# Altium schematic sheet Eurocard VME 6U P1.schdoc: FPGA Motherboard for Digital Multiplexed Readout, McGill U.
size B; DocumentNumber: DfMUX24; Revision: Rev0, Prototype; SheetNumber: 24; SheetTotal: 27; PageSetup: Record=PageOptions|CenterHorizontal=True|CenterVertical=True|PrintScale=1.08|XCorrection=1.00|YCorrection=1.00|PrintKind=0|BorderSize=5000000|LeftOffset=0|BottomOffset=0|Orientation=2|PaperLength=1000|PaperWidth=1000|Scale=100|PaperSource=7|PrintQuality=-4|MediaType=1|DitherType=10|PaperKind=Tabloid|PrintScaleMode=1
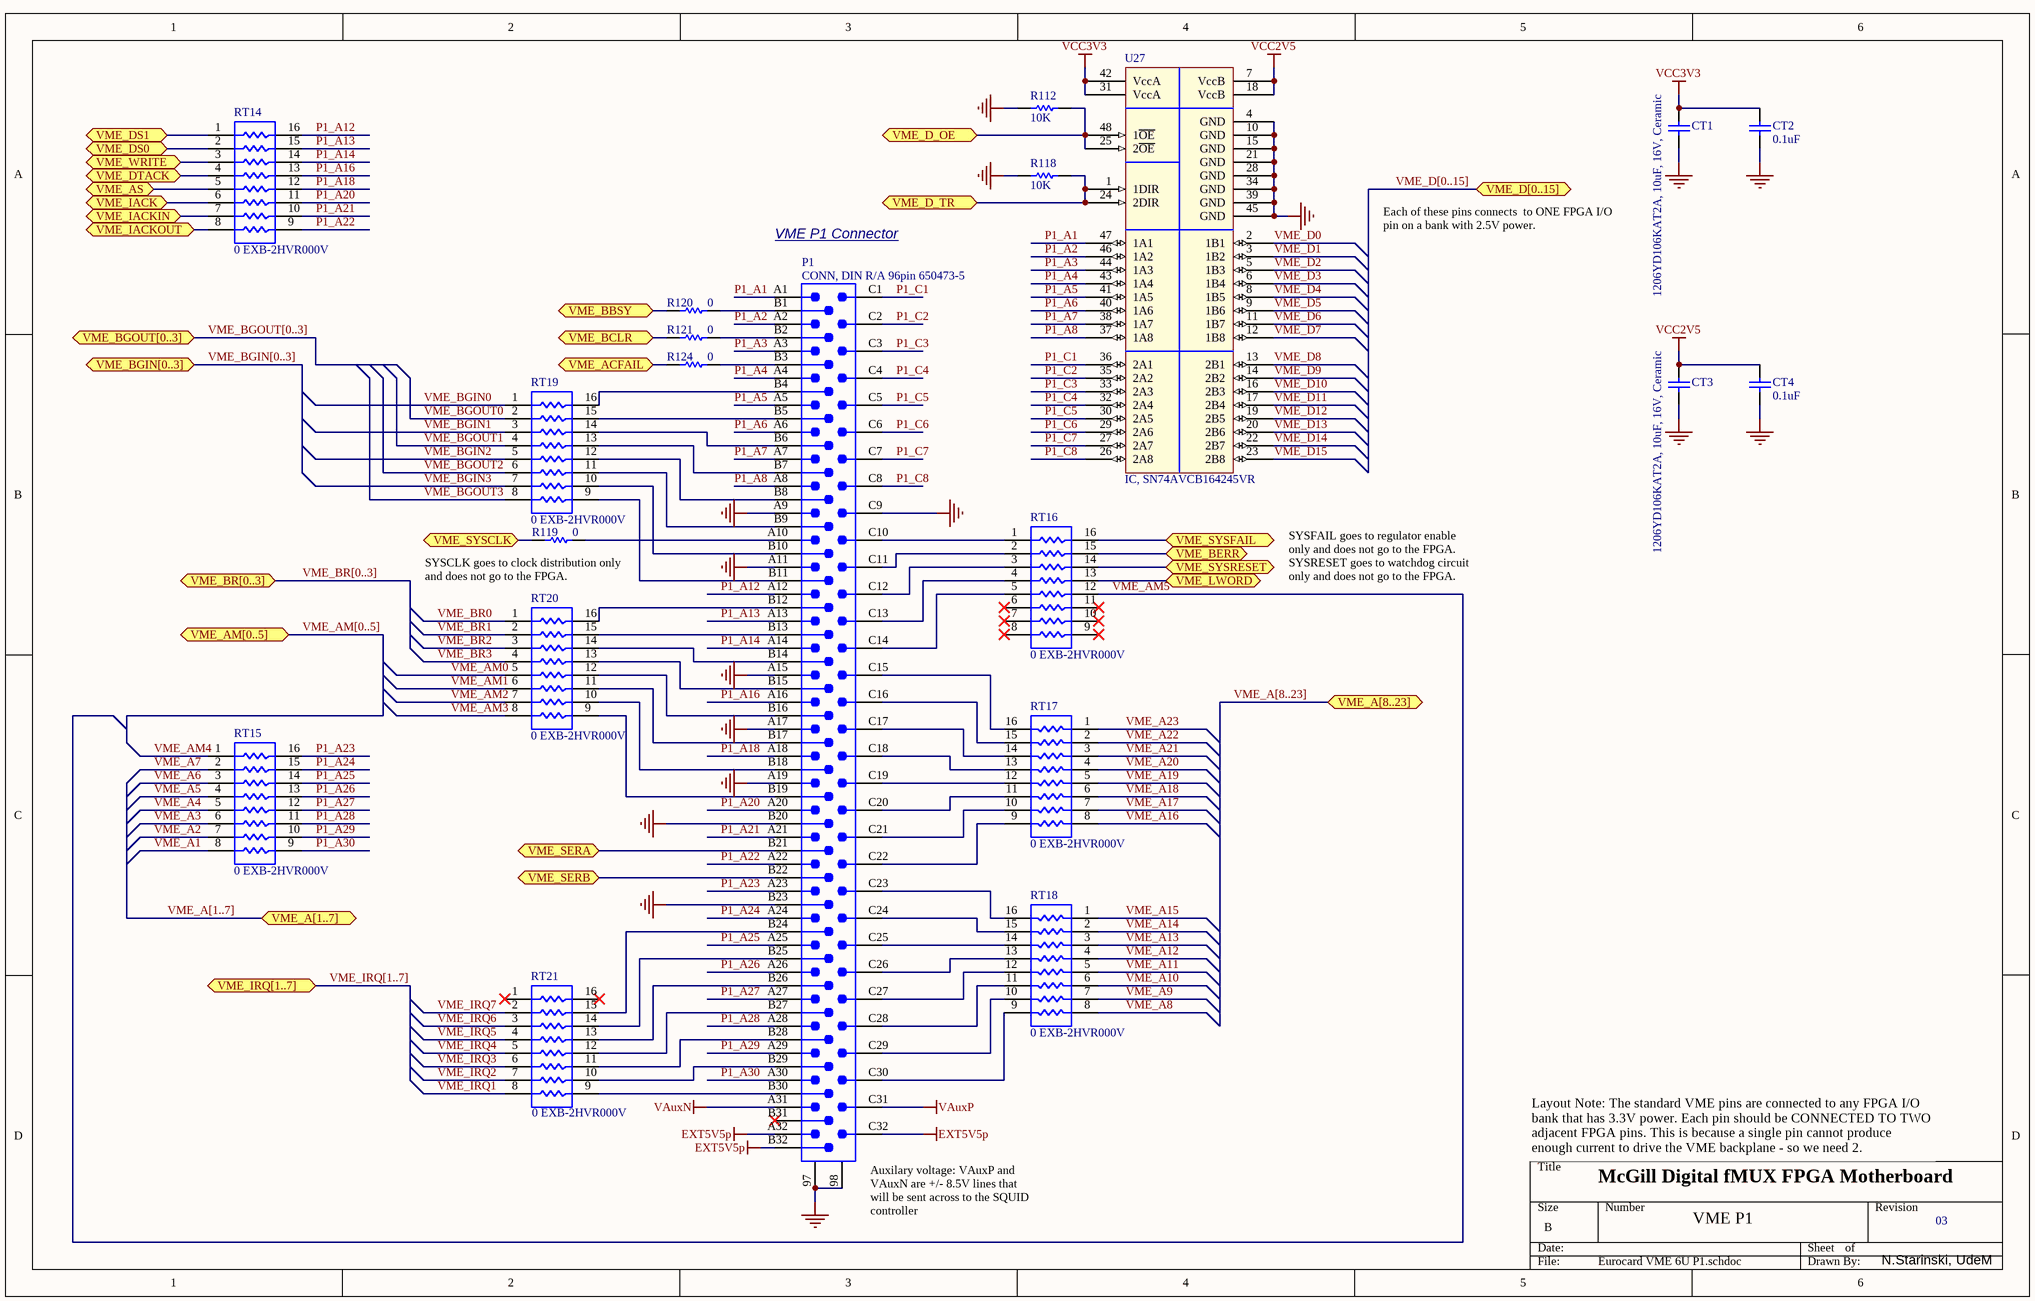
[diagram p0: Eurocard VME 6U P1.schdoc]

## Parts
CT1  1206YD106KAT2A, 10uF, 16V, Ceramic  [CC3225-1210]
CT2  0.1uF  [CC1608-0603]
CT3  1206YD106KAT2A, 10uF, 16V, Ceramic  [CC3225-1210]
CT4  0.1uF  [CC1608-0603]
P1  CONN, DIN R/A 96pin 650473-5  [CNVME96]
R112  10K  [CR1608-0603]
R118  10K  [CR1608-0603]
R119  0  [CR1608-0603]
R120  0  [CR1608-0603]
R121  0  [CR1608-0603]
R124  0  [CR1608-0603]
RT14  0 EXB-2HVR000V  [0402_Array_2HV]
RT15  0 EXB-2HVR000V  [0402_Array_2HV]
RT16  0 EXB-2HVR000V  [0402_Array_2HV]
RT17  0 EXB-2HVR000V  [0402_Array_2HV]
RT18  0 EXB-2HVR000V  [0402_Array_2HV]
RT19  0 EXB-2HVR000V  [0402_Array_2HV]
RT20  0 EXB-2HVR000V  [0402_Array_2HV]
RT21  0 EXB-2HVR000V  [0402_Array_2HV]
U27  IC, SN74AVCB164245VR  [DGV048]

## Ports
VME_A[1..7] (bidir), VME_A[8..23] (bidir), VME_ACFAIL (bidir), VME_AM[0..5] (bidir), VME_AS (bidir), VME_BBSY (bidir), VME_BCLR (bidir), VME_BERR (bidir), VME_BGIN[0..3] (bidir), VME_BGOUT[0..3] (bidir), VME_BR[0..3] (bidir), VME_D[0..15] (bidir), VME_D_OE (bidir), VME_D_TR (bidir), VME_DS0 (bidir), VME_DS1 (bidir), VME_DTACK (bidir), VME_IACK (bidir), VME_IACKIN (bidir), VME_IACKOUT (bidir), VME_IRQ[1..7] (bidir), VME_LWORD (bidir), VME_SERA (bidir), VME_SERB (bidir), VME_SYSCLK (bidir), VME_SYSFAIL (bidir), VME_SYSRESET (bidir), VME_WRITE (bidir)

## Nets
EXT5V5p: P1.A32 P1.B32 P1.C32
GND: CT1.2 CT2.2 CT3.2 CT4.2 P1.97 P1.98 P1.A9 P1.A11 P1.A15 P1.A17 P1.A19 P1.B20 P1.B23 P1.C9 R112.1 R118.1 U27.4(GND) U27.10(GND) U27.15(GND) U27.21(GND) U27.28(GND) U27.34(GND) U27.39(GND) U27.45(GND)
VAuxN: P1.A31
VAuxP: P1.C31
VCC2V5: CT3.1 CT4.1 U27.7(VccB) U27.18(VccB)
VCC3V3: CT1.1 CT2.1 U27.31(VccA) U27.42(VccA)
P1_A1: P1.A1 U27.47(1A1)
P1_A2: P1.A2 U27.46(1A2)
P1_A3: P1.A3 U27.44(1A3)
P1_A4: P1.A4 U27.43(1A4)
P1_A5: P1.A5 U27.41(1A5)
P1_A6: P1.A6 U27.40(1A6)
P1_A7: P1.A7 U27.38(1A7)
P1_A8: P1.A8 U27.37(1A8)
P1_A12: P1.A12 RT14.16
P1_A13: P1.A13 RT14.15
P1_A14: P1.A14 RT14.14
P1_A16: P1.A16 RT14.13
P1_A18: P1.A18 RT14.12
P1_A20: P1.A20 RT14.11
P1_A21: P1.A21 RT14.10
P1_A22: P1.A22 RT14.9
P1_A23: P1.A23 RT15.16
P1_A24: P1.A24 RT15.15
P1_A25: P1.A25 RT15.14
P1_A26: P1.A26 RT15.13
P1_A27: P1.A27 RT15.12
P1_A28: P1.A28 RT15.11
P1_A29: P1.A29 RT15.10
P1_A30: P1.A30 RT15.9
P1_C1: P1.C1 U27.36(2A1)
P1_C2: P1.C2 U27.35(2A2)
P1_C3: P1.C3 U27.33(2A3)
P1_C4: P1.C4 U27.32(2A4)
P1_C5: P1.C5 U27.30(2A5)
P1_C6: P1.C6 U27.29(2A6)
P1_C7: P1.C7 U27.27(2A7)
P1_C8: P1.C8 U27.26(2A8)
VME_A1: RT15.8
VME_A2: RT15.7
VME_A3: RT15.6
VME_A4: RT15.5
VME_A5: RT15.4
VME_A6: RT15.3
VME_A7: RT15.2
VME_A8: RT18.8
VME_A9: RT18.7
VME_A10: RT18.6
VME_A11: RT18.5
VME_A12: RT18.4
VME_A13: RT18.3
VME_A14: RT18.2
VME_A15: RT18.1
VME_A16: RT17.8
VME_A17: RT17.7
VME_A18: RT17.6
VME_A19: RT17.5
VME_A20: RT17.4
VME_A21: RT17.3
VME_A22: RT17.2
VME_A23: RT17.1
VME_ACFAIL: R124.1 ; port VME_ACFAIL
VME_AM0: RT20.5
VME_AM1: RT20.6
VME_AM2: RT20.7
VME_AM3: RT20.8
VME_AM4: RT15.1
VME_AM5: RT16.12
VME_AS: RT14.5 ; port VME_AS
VME_BBSY: R120.1 ; port VME_BBSY
VME_BCLR: R121.1 ; port VME_BCLR
VME_BERR: RT16.15 ; port VME_BERR
VME_BGIN0: RT19.1
VME_BGIN1: RT19.3
VME_BGIN2: RT19.5
VME_BGIN3: RT19.7
VME_BGOUT0: RT19.2
VME_BGOUT1: RT19.4
VME_BGOUT2: RT19.6
VME_BGOUT3: RT19.8
VME_BR0: RT20.1
VME_BR1: RT20.2
VME_BR2: RT20.3
VME_BR3: RT20.4
VME_D0: U27.2(1B1)
VME_D1: U27.3(1B2)
VME_D2: U27.5(1B3)
VME_D3: U27.6(1B4)
VME_D4: U27.8(1B5)
VME_D5: U27.9(1B6)
VME_D6: U27.11(1B7)
VME_D7: U27.12(1B8)
VME_D8: U27.13(2B1)
VME_D9: U27.14(2B2)
VME_D10: U27.16(2B3)
VME_D11: U27.17(2B4)
VME_D12: U27.19(2B5)
VME_D13: U27.20(2B6)
VME_D14: U27.22(2B7)
VME_D15: U27.23(2B8)
VME_D_OE: R112.2 U27.25(2~{OE}) U27.48(1~{OE}) ; port VME_D_OE
VME_D_TR: R118.2 U27.1(1DIR) U27.24(2DIR) ; port VME_D_TR
VME_DS0: RT14.2 ; port VME_DS0
VME_DS1: RT14.1 ; port VME_DS1
VME_DTACK: RT14.4 ; port VME_DTACK
VME_IACK: RT14.6 ; port VME_IACK
VME_IACKIN: RT14.7 ; port VME_IACKIN
VME_IACKOUT: RT14.8 ; port VME_IACKOUT
VME_IRQ1: RT21.8
VME_IRQ2: RT21.7
VME_IRQ3: RT21.6
VME_IRQ4: RT21.5
VME_IRQ5: RT21.4
VME_IRQ6: RT21.3
VME_IRQ7: RT21.2
VME_LWORD: RT16.13 ; port VME_LWORD
VME_SERA: P1.B21 ; port VME_SERA
VME_SERB: P1.B22 ; port VME_SERB
VME_SYSCLK: R119.1 ; port VME_SYSCLK
VME_SYSFAIL: RT16.16 ; port VME_SYSFAIL
VME_SYSRESET: RT16.14 ; port VME_SYSRESET
VME_WRITE: RT14.3 ; port VME_WRITE
NetP1_A10: P1.A10 R119.2
NetP1_B1: P1.B1 R120.2
NetP1_B2: P1.B2 R121.2
NetP1_B3: P1.B3 R124.2
NetP1_B4: P1.B4 RT19.16
NetP1_B5: P1.B5 RT19.15
NetP1_B6: P1.B6 RT19.14
NetP1_B7: P1.B7 RT19.13
NetP1_B8: P1.B8 RT19.12
NetP1_B9: P1.B9 RT19.11
NetP1_B10: P1.B10 RT19.10
NetP1_B11: P1.B11 RT19.9
NetP1_B12: P1.B12 RT20.16
NetP1_B13: P1.B13 RT20.15
NetP1_B14: P1.B14 RT20.14
NetP1_B15: P1.B15 RT20.13
NetP1_B16: P1.B16 RT20.12
NetP1_B17: P1.B17 RT20.11
NetP1_B18: P1.B18 RT20.10
NetP1_B19: P1.B19 RT20.9
NetP1_B24: P1.B24 RT21.15
NetP1_B25: P1.B25 RT21.14
NetP1_B26: P1.B26 RT21.13
NetP1_B27: P1.B27 RT21.12
NetP1_B28: P1.B28 RT21.11
NetP1_B29: P1.B29 RT21.10
NetP1_B30: P1.B30 RT21.9
NetP1_C10: P1.C10 RT16.1
NetP1_C11: P1.C11 RT16.2
NetP1_C12: P1.C12 RT16.3
NetP1_C13: P1.C13 RT16.4
NetP1_C14: P1.C14 RT16.5
NetP1_C15: P1.C15 RT17.16
NetP1_C16: P1.C16 RT17.15
NetP1_C17: P1.C17 RT17.14
NetP1_C18: P1.C18 RT17.13
NetP1_C19: P1.C19 RT17.12
NetP1_C20: P1.C20 RT17.11
NetP1_C21: P1.C21 RT17.10
NetP1_C22: P1.C22 RT17.9
NetP1_C23: P1.C23 RT18.16
NetP1_C24: P1.C24 RT18.15
NetP1_C25: P1.C25 RT18.14
NetP1_C26: P1.C26 RT18.13
NetP1_C27: P1.C27 RT18.12
NetP1_C28: P1.C28 RT18.11
NetP1_C29: P1.C29 RT18.10
NetP1_C30: P1.C30 RT18.9

Not connected (* = marked no-connect by the designer): P1 B31*; RT16 6* 7* 8* 9* 10* 11*; RT21 1* 16*

## Buses and harness runs
bus VME_A[1..7] = port VME_A[1..7]
bus VME_A[8..23] = port VME_A[8..23]
bus VME_AM[0..5] = port VME_AM[0..5]
bus VME_BGIN[0..3] = port VME_BGIN[0..3]
bus VME_BGOUT[0..3] = port VME_BGOUT[0..3]
bus VME_BR[0..3] = port VME_BR[0..3]
bus VME_D[0..15] = port VME_D[0..15]
bus VME_IRQ[1..7] = port VME_IRQ[1..7]

## Notes on the sheet
- VME P1 Connector
- Each of these pins connects  to ONE FPGA I/O pin on a bank with 2.5V power.
- (near R119) SYSCLK goes to clock distribution only and does not go to the FPGA.
- SYSFAIL goes to regulator enable only and does not go to the FPGA.
  SYSRESET goes to watchdog circuit only and does not go to the FPGA.
- Layout Note: The standard VME pins are connected to any FPGA I/O bank that has 3.3V power. Each pin should be CONNECTED TO TWO adjacent FPGA pins. This is because a single pin cannot produce enough current to drive the VME backplane - so we need 2.
- McGill Digital fMUX FPGA Motherboard
- (near P1) Auxilary voltage: VAuxP and VAuxN are +/- 8.5V lines that will be sent across to the SQUID controller
- VME P1
- 03
- N.Starinski, UdeM

## Library data of the parts
CT1 CT3 = Cap Semi: CAP POL 1206YD106KAT2A; Published: 8-Jun-2000; LatestRevisionDate: 17-Jul-2002; LatestRevisionNote: Re-released for DXP Platform.; PackageReference: C1206; Publisher: Altium Limited
CT2 CT4 = Cap Semi: Capacitor (Semiconductor SIM Model); Published: 8-Jun-2000; LatestRevisionDate: 17-Jul-2002; LatestRevisionNote: Re-released for DXP Platform.; PackageReference: C1206; Publisher: Altium Limited
P1 = CNVME96: 96-Pin Connector (3x32 2.54mm grid); Text Field6: Alternate Layout Available; Text Field7: Published 14-Feb-2002
R112 R118-R121 R124 = Res Semi: Resistor 0603; Published: 8-Jun-2000; LatestRevisionDate: 17-Jul-2002; LatestRevisionNote: Re-released for DXP Platform.; Publisher: Altium Limited
RT14-RT21 = Res Pack3: Isolated Resistor Network; Published: 24-Mar-1999; LatestRevisionDate: 17-Jul-2002; LatestRevisionNote: Re-released for DXP Platform.; Publisher: Altium Limited
U27 = SN74AVCB164245: 16-Bit Dual-Supply Bus Transceiver with CVT and 3-state